# Altium schematic sheet PDB_Sheet1.SchDoc: PDB1.0_Core
size A2; SheetNumber: 1; SheetTotal: 1
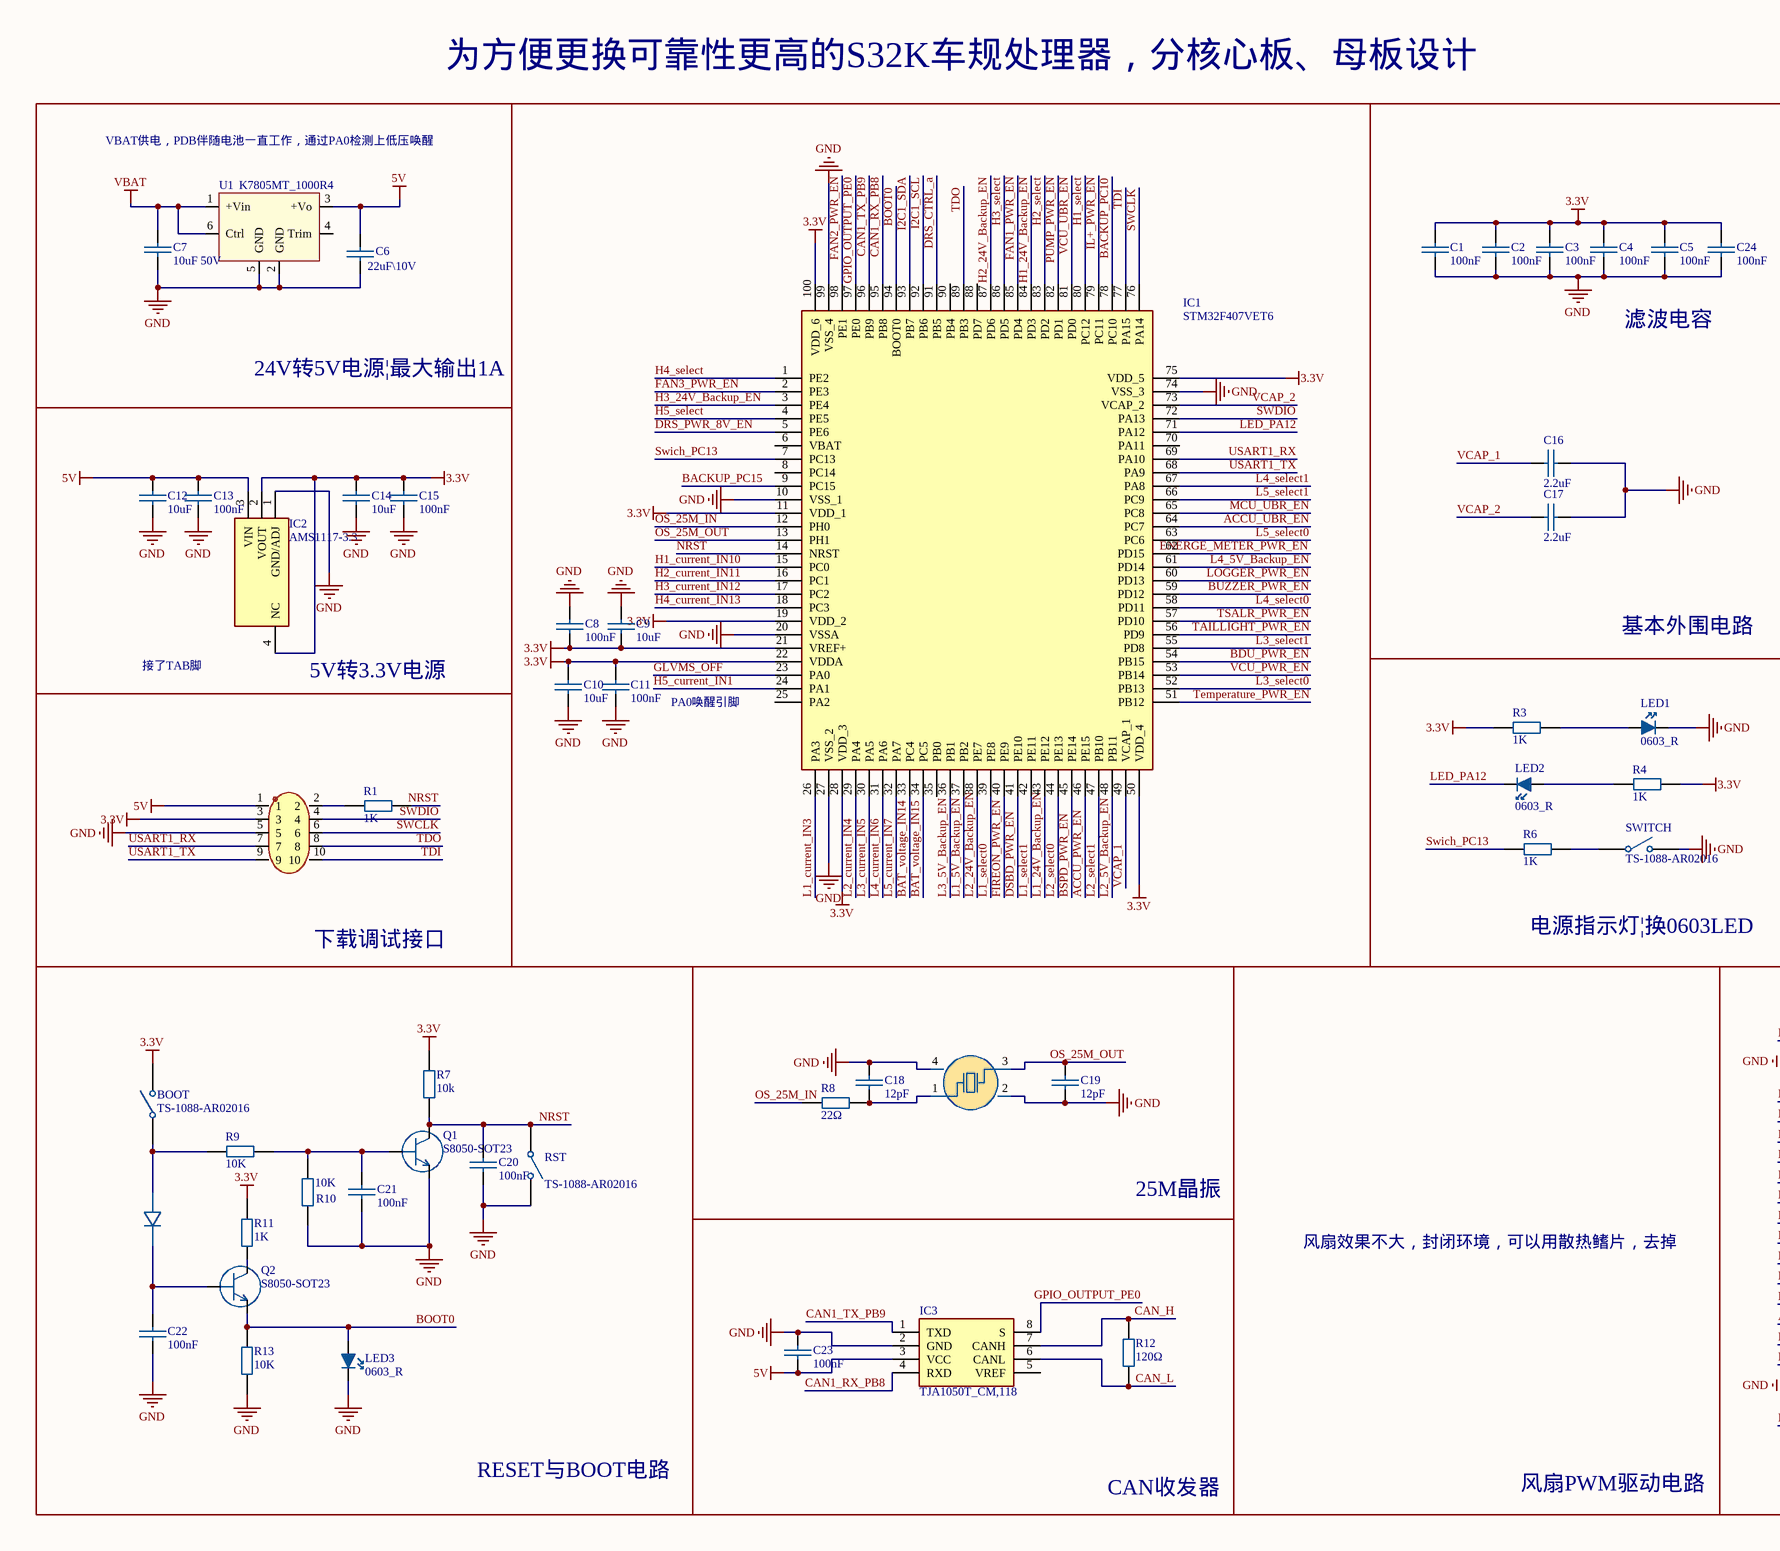
[diagram p0: PDB_Sheet1.SchDoc, left]
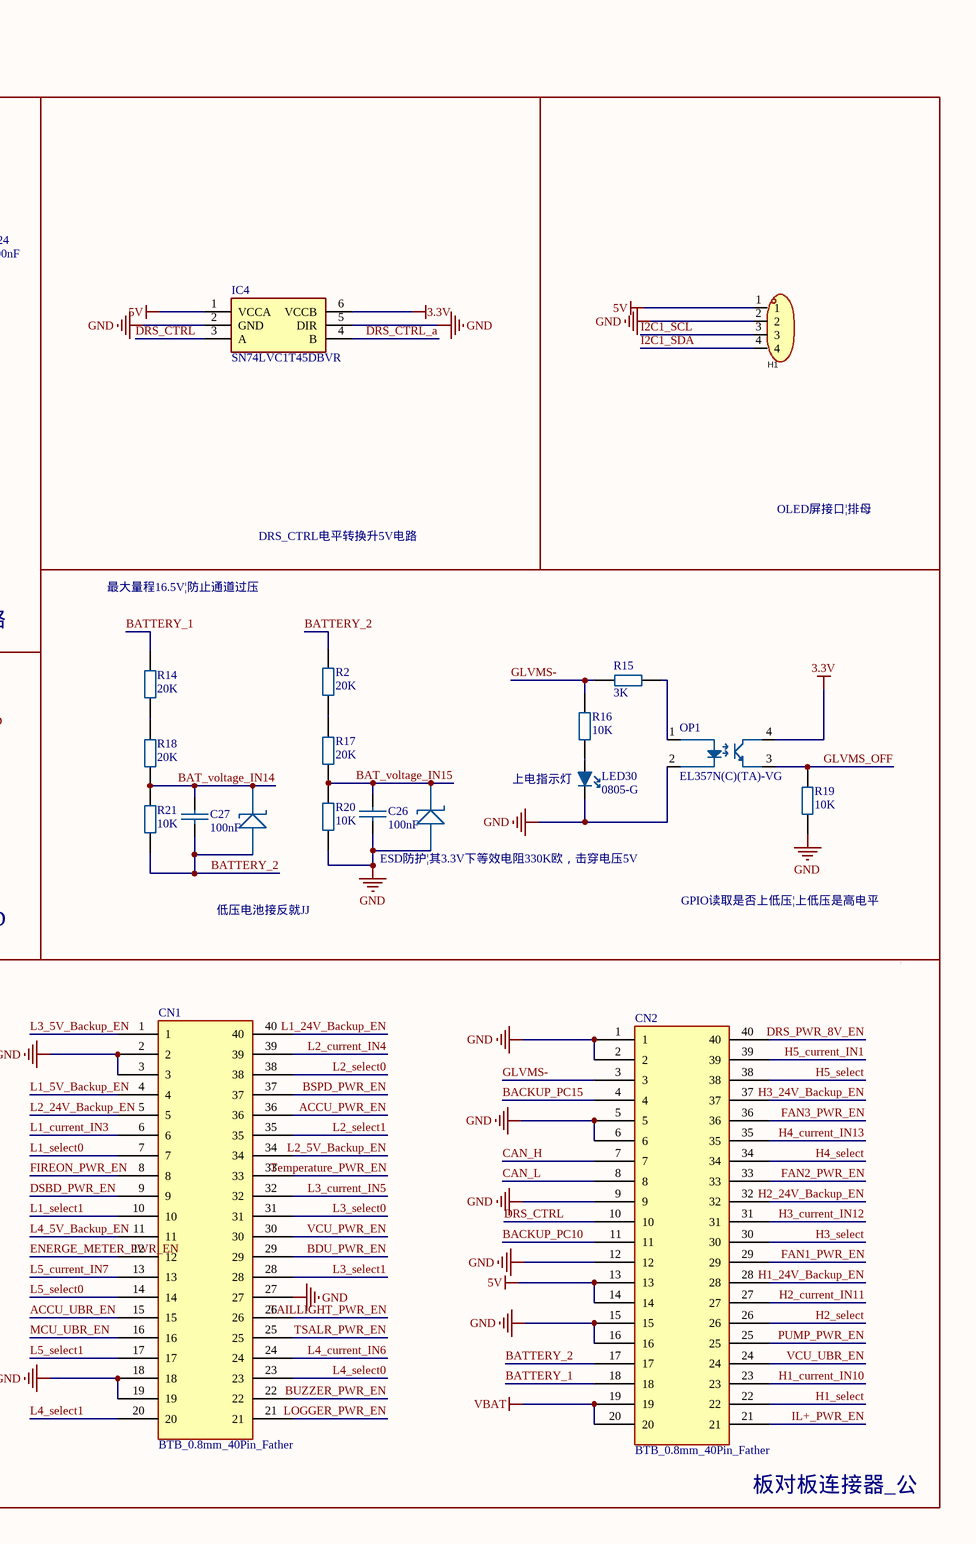
[diagram p1: PDB_Sheet1.SchDoc, right]

## Parts
BOOT  TS-1088-AR02016  [SW-SMD_L3.9-W3.0-P4.45]
C1  100nF  [CAPC1608X08N__0603CAPUNPOLE]
C2  100nF  [CAPC1608X08N__0603CAPUNPOLE]
C3  100nF  [CAPC1608X08N__0603CAPUNPOLE]
C4  100nF  [CAPC1608X08N__0603CAPUNPOLE]
C5  100nF  [CAPC1608X08N__0603CAPUNPOLE]
C6  22uF\10V  [CAPC1608X08N__0603CAPUNPOLE]
C7  10uF 50V  [CAPC3216X16N_1206CAPUNPOLE]
C8  100nF  [CAPC1608X08N__0603CAPUNPOLE]
C9  10uF  [CAPC1608X08N__0603CAPUNPOLE]
C10  10uF  [CAPC1608X08N__0603CAPUNPOLE]
C11  100nF  [CAPC1608X08N__0603CAPUNPOLE]
C12  10uF  [CAPC1608X08N__0603CAPUNPOLE]
C13  100nF  [CAPC1608X08N__0603CAPUNPOLE]
C14  10uF  [CAPC1608X08N__0603CAPUNPOLE]
C15  100nF  [CAPC1608X08N__0603CAPUNPOLE]
C16  2.2uF  [CAPC1608X08N__0603CAPUNPOLE]
C17  2.2uF  [CAPC1608X08N__0603CAPUNPOLE]
C18  12pF  [CAPC1608X08N__0603CAPUNPOLE]
C19  12pF  [CAPC1608X08N__0603CAPUNPOLE]
C20  100nF  [CAPC1608X08N__0603CAPUNPOLE]
C21  100nF  [CAPC1608X08N__0603CAPUNPOLE]
C22  100nF  [CAPC1608X08N__0603CAPUNPOLE]
C23  100nF  [CAPC1608X08N__0603CAPUNPOLE]
C24  100nF  [CAPC1608X08N__0603CAPUNPOLE]
C26  100nF  [CAPC1608X08N__0603CAPUNPOLE]
C27  100nF  [CAPC1608X08N__0603CAPUNPOLE]
CN1  BTB_0.8mm_40Pin_Father  [BTB_0.8mm_40PIN_F]
CN2  BTB_0.8mm_40Pin_Father  [BTB_0.8mm_40PIN_F]
D1  1N4148WS_C2128  [SOD-323_L1.8-W1.3-LS2.5-RD]  (value not drawn)
E1  CESD3V3D3 YU  [SOD-323_L1.8-W1.3-LS2.5-RD]  (value not drawn)
E2  CESD3V3D3 YU  [SOD-323_L1.8-W1.3-LS2.5-RD]  (value not drawn)
H1  2.54-1*4P母  [HDR-TH_4P-P2.54-V-F]  (value not drawn)
IC1  STM32F407VET6  [QFP50P1600X1600X160-100N]
IC2  AMS1117-3.3  [SOT229P700X180-4N]
IC3  TJA1050T_CM,118  [SOIC127P600X175-8N]
IC4  SN74LVC1T45DBVR  [SOT95P280X145-6N]
LED1  0603_R  [LED0603-RD_RED]
LED2  0603_R  [LED0603-RD_RED]
LED3  0603_R  [LED0603-RD_RED]
LED30  0805-G  [DIOC2012X11N__0805DIO]
OP1  EL357N(C)(TA)-VG  [SOP-4-2.54mm]
Q1  S8050-SOT23  [SOT95P245X110-3N]
Q2  S8050-SOT23  [SOT95P245X110-3N]
R1  1K  [RESC3116X06N__1206RES]
R2  20K  [RESC1608X04N_0603RES]
R3  1K  [RESC1608X04N_0603RES]
R4  1K  [RESC1608X04N_0603RES]
R6  1K  [RESC1608X04N_0603RES]
R7  10k  [RESC1608X04N_0603RES]
R8  22Ω  [RESC1608X04N_0603RES]
R9  10K  [RESC1608X04N_0603RES]
R10  10K  [RESC1608X04N_0603RES]
R11  1K  [RESC1608X04N_0603RES]
R12  120Ω  [RESC1608X04N_0603RES]
R13  10K  [RESC1608X04N_0603RES]
R14  20K  [RESC1608X04N_0603RES]
R15  3K  [RESC1608X04N_0603RES]
R16  10K  [RESC1608X04N_0603RES]
R17  20K  [RESC1608X04N_0603RES]
R18  20K  [RESC1608X04N_0603RES]
R19  10K  [RESC1608X04N_0603RES]
R20  10K  [RESC1608X04N_0603RES]
R21  10K  [RESC1608X04N_0603RES]
RST  TS-1088-AR02016  [SW-SMD_L3.9-W3.0-P4.45]
SWITCH  TS-1088-AR02016  [SW-SMD_L3.9-W3.0-P4.45]
U1  K7805MT_1000R4  [K7805MT_500R4]
U2  ZX-PZ2.54-2-5PZZ  [HDR-TH_10P-P2.54-V-M-R2-C5-S2.54]  (value not drawn)
X1  X322525MOB4SI  [OSC-SMD_4P-L3.2-W2.5-BL]  (value not drawn)

## Blocks framed on the sheet
24V转5V电源¦最大输出1A: C6 C7 U1
PA0唤醒引脚: C8-C11 IC1
DRS_CTRL电平转换升5V电路: IC4
OLED屏接口¦排母: H1
5V转3.3V电源: C12-C15 IC2
25M晶振: C18 C19 R8 X1
板对板连接器_公: CN1 CN2
CAN收发器: C23 IC3 R12

## Nets
3.3V: BOOT.2(NO) C1.2 C2.2 C3.2 C4.2 C5.2 C8.2 C9.2 C10.2 C11.2 C14.2 C15.2 C24.2 IC1.11(VDD_1) IC1.19(VDD_2) IC1.21(VREF+) IC1.22(VDDA) IC1.28(VDD_3) IC1.50(VDD_4) IC1.75(VDD_5) IC1.100(VDD_6) IC2.2(VOUT) IC2.4(NC) IC4.6(VCCB) OP1.4 R3.1 R4.2 R7.2 R11.2 U2.3
5V: C6.2 C12.2 C13.2 C23.2 CN2.13 CN2.14 H1.1 IC2.3(VIN) IC3.3(VCC) IC4.1(VCCA) U1.3(+Vo) U2.1
GND: C1.1 C2.1 C3.1 C4.1 C5.1 C6.1 C7.1 C8.1 C9.1 C10.1 C11.1 C12.1 C13.1 C14.1 C15.1 C16.2 C17.2 C18.2 C19.1 C20.1 C21.1 C22.1 C23.1 C24.1 C26.1 CN1.2 CN1.3 CN1.18 CN1.19 CN1.27 CN2.1 CN2.2 CN2.5 CN2.6 CN2.9 CN2.12 CN2.15 CN2.16 E1.2 H1.2 IC1.10(VSS_1) IC1.20(VSSA) IC1.27(VSS_2) IC1.74(VSS_3) IC1.99(VSS_4) IC2.1(GND/ADJ) IC3.2(GND) IC4.2(GND) IC4.5(DIR) LED1.1 LED3.1 LED30.1 OP1.2 Q1.2(Emitter) R10.1 R13.1 R19.1 R20.2 RST.2(NO) SWITCH.2(NO) U1.2(GND) U1.5(GND) U2.5 X1.2(GND) X1.4(GND)
VBAT: C7.2 CN2.19 CN2.20 U1.1(+Vin) U1.6(Ctrl)
ACCU_PWR_EN: CN1.36 IC1.46(PE15)
ACCU_UBR_EN: CN1.15 IC1.64(PC7)
BACKUP_PC10: CN2.11 IC1.78(PC10)
BACKUP_PC15: CN2.4 IC1.9(PC15)
BAT_voltage_IN14: C27.2 E2.1 IC1.33(PC4) R18.2 R21.1
BAT_voltage_IN15: C26.2 E1.1 IC1.34(PC5) R17.2 R20.1
BATTERY_1: CN2.18 R14.2
BATTERY_2: C27.1 CN2.17 E2.2 R2.2 R21.2
BDU_PWR_EN: CN1.29 IC1.54(PB15)
BOOT0: IC1.94(BOOT0) LED3.2 Q2.2(Emitter) R13.2
BSPD_PWR_EN: CN1.37 IC1.45(PE14)
BUZZER_PWR_EN: CN1.22 IC1.59(PD12)
CAN1_RX_PB8: IC1.95(PB8) IC3.4(RXD)
CAN1_TX_PB9: IC1.96(PB9) IC3.1(TXD)
CAN_H: CN2.7 IC3.7(CANH) R12.2
CAN_L: CN2.8 IC3.6(CANL) R12.1
DRS_CTRL: CN2.10 IC4.3(A)
DRS_CTRL_a: IC1.91(PB5) IC4.4(B)
DRS_PWR_8V_EN: CN2.40 IC1.5(PE6)
DSBD_PWR_EN: CN1.9 IC1.41(PE10)
ENERGE_METER_PWR_EN: CN1.12 IC1.62(PD15)
FAN1_PWR_EN: CN2.29 IC1.85(PD4)
FAN2_PWR_EN: CN2.33 IC1.98(PE1)
FAN3_PWR_EN: CN2.36 IC1.2(PE3)
FIREON_PWR_EN: CN1.8 IC1.40(PE9)
GLVMS-: CN2.3 R15.2 R16.2
GLVMS_OFF: IC1.23(PA0) OP1.3 R19.2
GPIO_OUTPUT_PE0: IC1.97(PE0) IC3.8(S)
H1_24V_Backup_EN: CN2.28 IC1.84(PD3)
H1_current_IN10: CN2.23 IC1.15(PC0)
H1_select: CN2.22 IC1.80(PC12)
H2_24V_Backup_EN: CN2.32 IC1.87(PD6)
H2_current_IN11: CN2.27 IC1.16(PC1)
H2_select: CN2.26 IC1.83(PD2)
H3_24V_Backup_EN: CN2.37 IC1.3(PE4)
H3_current_IN12: CN2.31 IC1.17(PC2)
H3_select: CN2.30 IC1.86(PD5)
H4_current_IN13: CN2.35 IC1.18(PC3)
H4_select: CN2.34 IC1.1(PE2)
H5_current_IN1: CN2.39 IC1.24(PA1)
H5_select: CN2.38 IC1.4(PE5)
I2C1_SCL: H1.3 IC1.92(PB6)
I2C1_SDA: H1.4 IC1.93(PB7)
IL+_PWR_EN: CN2.21 IC1.79(PC11)
L1_5V_Backup_EN: CN1.4 IC1.37(PB2)
L1_24V_Backup_EN: CN1.40 IC1.43(PE12)
L1_current_IN3: CN1.6 IC1.26(PA3)
L1_select0: CN1.7 IC1.39(PE8)
L1_select1: CN1.10 IC1.42(PE11)
L2_5V_Backup_EN: CN1.34 IC1.48(PB11)
L2_24V_Backup_EN: CN1.5 IC1.38(PE7)
L2_current_IN4: CN1.39 IC1.29(PA4)
L2_select0: CN1.38 IC1.44(PE13)
L2_select1: CN1.35 IC1.47(PB10)
L3_5V_Backup_EN: CN1.1 IC1.36(PB1)
L3_current_IN5: CN1.32 IC1.30(PA5)
L3_select0: CN1.31 IC1.52(PB13)
L3_select1: CN1.28 IC1.55(PD8)
L4_5V_Backup_EN: CN1.11 IC1.61(PD14)
L4_current_IN6: CN1.24 IC1.31(PA6)
L4_select0: CN1.23 IC1.58(PD11)
L4_select1: CN1.20 IC1.67(PA8)
L5_current_IN7: CN1.13 IC1.32(PA7)
L5_select0: CN1.14 IC1.63(PC6)
L5_select1: CN1.17 IC1.66(PC9)
LED_PA12: IC1.71(PA12) LED2.1
LOGGER_PWR_EN: CN1.21 IC1.60(PD13)
MCU_UBR_EN: CN1.16 IC1.65(PC8)
NRST: C20.2 IC1.14(NRST) Q1.3(Collector) R1.2 R7.1 RST.1(COMMON)
OS_25M_IN: IC1.12(PH0) R8.1
OS_25M_OUT: C19.2 IC1.13(PH1) X1.3(OSC2)
PUMP_PWR_EN: CN2.25 IC1.82(PD1)
SWCLK: IC1.76(PA14) U2.6
SWDIO: IC1.72(PA13) U2.4
Swich_PC13: IC1.7(PC13) R6.1
TAILLIGHT_PWR_EN: CN1.26 IC1.56(PD9)
TDI: IC1.77(PA15) U2.10
TDO: IC1.89(PB3) U2.8
Temperature_PWR_EN: CN1.33 IC1.51(PB12)
TSALR_PWR_EN: CN1.25 IC1.57(PD10)
USART1_RX: IC1.69(PA10) U2.7
USART1_TX: IC1.68(PA9) U2.9
VCAP_1: C16.1 IC1.49(VCAP_1)
VCAP_2: C17.1 IC1.73(VCAP_2)
VCU_PWR_EN: CN1.30 IC1.53(PB14)
VCU_UBR_EN: CN2.24 IC1.81(PD0)
NetBOOT_1: BOOT.1(COMMON) D1.2(A) R9.1
NetC18_1: C18.1 R8.2 X1.1(OSC1)
NetC21_2: C21.2 Q1.1(Base) R9.2 R10.2
NetC22_2: C22.2 D1.1(K) Q2.1(Base)
NetLED1_2: LED1.2 R3.2
NetLED2_2: LED2.2 R4.1
NetLED30_2: LED30.2 R16.1
NetOP1_1: OP1.1 R15.1
NetQ2_3: Q2.3(Collector) R11.1
NetR1_1: R1.1 U2.2
NetR2_1: R2.1 R17.1
NetR6_2: R6.2 SWITCH.1(COMMON)
NetR14_1: R14.1 R18.1

Not connected (* = marked no-connect by the designer): IC1 6(VBAT) 8(PC14) 25(PA2) 35(PB0) 70(PA11) 88(PD7) 90(PB4); IC3 5(VREF); U1 4(Trim)

## Notes on the sheet
- 为方便更换可靠性更高的S32K车规处理器，分核心板、母板设计
- VBAT供电，PDB伴随电池一直工作，通过PA0检测上低压唤醒
- 滤波电容
- 最大量程16.5V¦防止通道过压
- 基本外围电路
- 接了TAB脚
- 上电指示灯
- ESD防护¦其3.3V下等效电阻330K欧，击穿电压5V
- 电源指示灯¦换0603LED
- 低压电池接反就JJ
- GPIO读取是否上低压¦上低压是高电平
- 下载调试接口
- 风扇效果不大，封闭环境，可以用散热鳍片，去掉
- RESET与BOOT电路
- 风扇PWM驱动电路
- ENG:
- DSN:
- APPROVALS
- DATE
- PROJECT REVISION:
- Vehicle Number:
- E33
- DOCUMENT REVISION:
- Wuhan University of Techonology
- Formula Student Electric Racing Team
- No. 122, Luoshi Road, Wuhan
- Hubei Provence, China
- Design Item:
- CHK:
- BOM:
- REFERENCE DOCUMENTS
- TITLE
- FAB DWG:
- PCB DWG:
- ASSY DWG:
- SCALE:
- A1
- SIZE
- FILE NAME
- WUTE racing team
- SHEET
- OF
- REV

## Library data of the parts
BOOT RST SWITCH = TS-1088-AR02016: Switch; Manufacturer_Name: XUNPU; Datasheet Link: https://www.xunpudianzi.com/uploads/pdf/TS-1088-ARXXX.pdf; Height: 2mm; Manufacturer_Part_Number: TS-1088-AR02016
C1-C5 C8-C24 C26 C27 = SMD_MLCC: Std MLCC Cap; voltage rating: ?V
  C1-C5 C8 C11 C13 C15 C20-C24 C26 C27: Type: 100nF
  C9 C10 C12 C14: Type: 10uF
  C16 C17: Type: 2.2uF
  C18 C19: Type: 12pF
C6 C7 = SMD_MLCC: Std MLCC Cap
  C6: Type: 22uF\10V
  C7: Type: 10uF 50V
CN1 CN2 = BTB_0.8mm_40Pin_Father: System: Connector
D1 = 1N4148WS_C2128: 二极管配置:独立式;功率:200mW;直流反向耐压(Vr):100V;平均整流电流(Io):150mA;正向压降(Vf):1.25V@150mA;反向电流(Ir):1uA@75V;反向恢复时间(trr):4ns;工作温度:+150℃@(Tj);; Manufacturer: CJ(江苏长电/长晶); Symbol: 1N4148WS T4; Add into BOM: yes; Diode Configuration: 独立式; Power Dissipation: 200mW; Reverse Voltage (Vr): 100V; Average Rectified Current (Io): 150mA; Reverse Recovery Time (trr): 4ns; Name: 1N4148WS; Device: 1N4148WS_C2128; LCSC Part Name: 100V 150mA 4ns T4; Supplier Part: C2128; Manufacturer Part: 1N4148WS; Supplier Footprint: SOD-323; Supplier: LCSC; Convert to PCB: yes; Forward Voltage (Vf@If): 1.25V@150mA; Reverse Leakage Current: 1uA@75V; Operating Temperature: +150℃@(Tj)
E1 E2 = CESD3V3D3 YU: 极性:单向;反向截止电压(Vrwm):3.3V;击穿电压(VBR):5V;钳位电压(Vc)@Ipp:13V;; Manufacturer: CJ(江苏长电/长晶); Add into BOM: yes; Polarity: 单向; Reverse Stand-Off Voltage (Vrwm): 3.3V; Breakdown Voltage (VBR): 5V; Peak Pulse Current(Ipp)@8/20us: 16A; Clamping Voltage@Ipp: 13V; Name: CESD3V3D3 YU; Symbol: CESD3V3D3; Device: CESD3V3D3 YU; LCSC Part Name: 单向ESD; Supplier Part: C38388; Manufacturer Part: CESD3V3D3 YU; Supplier Footprint: SOD-323; Datasheet: https://atta.szlcsc.com/upload/public/pdf/source/20150915/1457707371129.pdf; Supplier: LCSC; Convert to PCB: yes
H1 = 2.54-1*4P母: 立创编号：C2718488; Manufacturer: BOOMELE(博穆精密); Add into BOM: yes; Holes Structure: 1x4P; Pitch: 2.54mm; Circular Hole / Square Hole: 方孔; Number of Holes: 4P; Current Rating (Max): 3A; Holes Direction: 顶部; Symbol: 2.54-1*4P母; Device: 2.54-1*4P母; Supplier: LCSC; Supplier Part: C2718488; Manufacturer Part: 2.54-1*4P母; JLCPCB Part Class: Extended Part; LCSC Part Name: 间距:2.54mm 1x4P 直插; Supplier Footprint: 插件,P=2.54mm; Datasheet: https://atta.szlcsc.com/upload/public/pdf/source/20210301/C2718488_F4427B881E42CAA8DDB0B1C12B3A522C.pdf; Convert to PCB: yes; Row Spacing: -; Mounting Type: 直插; Number of Rows: 单排; Voltage Rating (Max): -; Insulation Height: -; Contact Material: 青铜; Contact Plating: -; Operating Temperature Range: -40℃~+105℃; Soldering Temperature(Max): -
IC1 = STM32F407VET6: Integrated Circuit; Manufacturer_Name: STMicroelectronics; Datasheet Link: http://www.st.com/web/en/resource/technical/document/datasheet/DM00037051.pdf; Height: 1.6mm; Manufacturer_Part_Number: STM32F407VET6; Mouser Part Number: 511-STM32F407VET6; Mouser Price/Stock: https://www.mouser.co.uk/ProductDetail/STMicroelectronics/STM32F407VET6?qs=Z8%252BeY1k3TIJFAMMqSR%252BGtw%3D%3D; Arrow Part Number: STM32F407VET6; Arrow Price/Stock: https://www.arrow.com/en/products/stm32f407vet6/stmicroelectronics?region=nac
IC2 = AMS1117-3.3: Integrated Circuit; Manufacturer_Name: Advanced; Datasheet Link: https://datasheet.datasheetarchive.com/originals/distributors/Datasheets-28/DSA-550594.pdf; Height: 1.8mm; Manufacturer_Part_Number: AMS1117-3.3
IC3 = TJA1050T_CM,118: Integrated Circuit; Manufacturer_Name: NXP; Manufacturer_Part_Number: TJA1050T/CM,118; Datasheet Link: http://www.nxp.com/docs/en/data-sheet/TJA1050.pdf; Height: 1.75mm; Mouser Part Number: 771-TJA1050T/CM118; Mouser Price/Stock: https://www.mouser.co.uk/ProductDetail/NXP-Semiconductors/TJA1050T-CM118?qs=5XOdhvmYM0NFFspw0VP5sA%3D%3D; Arrow Part Number: TJA1050T/CM,118; Arrow Price/Stock: https://www.arrow.com/en/products/tja1050tcm118/nxp-semiconductors?region=europe
IC4 = SN74LVC1T45DBVR: Integrated Circuit / 电平转换模块 立创编号：C7843; Manufacturer_Name: Texas Instruments; Datasheet Link: https://componentsearchengine.com/Datasheets/2/SN74LVC1T45DBVR.pdf; Height: 1.45mm; Manufacturer_Part_Number: SN74LVC1T45DBVR; Mouser Part Number: 595-SN74LVC1T45DBVR; Mouser Price/Stock: https://www.mouser.co.uk/ProductDetail/Texas-Instruments/SN74LVC1T45DBVR?qs=pajgIaoyDUhg6sKXdsM%2Fvg%3D%3D; Arrow Part Number: SN74LVC1T45DBVR; Arrow Price/Stock: https://www.arrow.com/en/products/sn74lvc1t45dbvr/texas-instruments?region=nac
LED1-LED3 = LED: Light Emitting Diode; Type: 0805-R; Type2: DIP-HDR1*2-R
LED30 = LED: Light Emitting Diode; Type2: DIP-HDR1*2-R; Type: 0805-G
OP1 = EL357N(C)(TA)-VG: No Description Available / 立创编号：C108648; Mfr_Name: Everlight; RefDes: RefDes; Type: Type
Q1 Q2 = S8050: Jellybeam NPN; Type: S8050-SOT23
R1-R4 R6-R14 R20 R21 = SMD_Resistor: Std Resistor; power rating: 100mW; voltage rating: 75V
  R1 R3 R4 R6 R11: Type: 1K
  R2 R14: Type: 20K
  R7: Type: 10k
  R8: Type: 22Ω
  R9 R10 R13 R20 R21: Type: 10K
  R12: Type: 120Ω
R15-R19 = SMD_Resistor: Std Resistor
  R15: Type: 3K
  R16 R19: Type: 10K
  R17 R18: Type: 20K
U1 = K78052MT_1000R4
U2 = ZX-PZ2.54-2-5PZZ: Manufacturer: Megastar(兆星); Add into BOM: yes; Pin Structure: 2x5P; Pitch: 2.54mm; Circluar Pins/Square Pins: 方针; Current Rating (Max): 3A; Voltage Rating (Max): 1kV; Soldering Temperature(Max): 260℃@5s; Symbol: ZX-PZ2.54-2-5PZZ; Device: ZX-PZ2.54-2-5PZZ; Supplier: LCSC; Supplier Part: C7501276; Manufacturer Part: ZX-PZ2.54-2-5PZZ; JLCPCB Part Class: Extended Part; LCSC Part Name: 间距:2.54mm 2x5P 直插 方针; Supplier Footprint: 插件,P=2.54mm; Datasheet: https://atta.szlcsc.com/upload/public/pdf/source/20231122/7DD2FA5A7FDBC10CDDB6051CB6BC6AD1.pdf; Convert to PCB: yes; Row Spacing: 2.54mm; Mounting Type: 直插; Number of Rows: 双排; Number of Pins: 5P; Length of Mating Pin: 6mm; Insulation Height: 2.5mm; Length of End Connection Pin: 3mm; Contact Material: 黄铜; Contact Plating: 金; Operating Temperature Range: -40℃~+105℃; Color: 黑色
X1 = X322525MOB4SI: 频率:25MHz;频率公差:±10ppm;负载电容:12pF;; Manufacturer: YXC(扬兴晶振); Name: 25MHz; Add into BOM: yes; Crystal Type: 贴片无源晶振; Value: 25MHz; Frequency Tolerance: ±10ppm; Frequency Stability: ±30ppm; Load Capacitance: 12pF; Symbol: X322525MOB4SI; Device: X322525MOB4SI; LCSC Part Name: 25MHz ±10ppm 12pF YSX321SL; Supplier Part: C9006; Manufacturer Part: X322525MOB4SI; Supplier Footprint: SMD3225-4P; Datasheet: https://atta.szlcsc.com/upload/public/pdf/source/20210329/C112971_1F611BDC486E193C1706F6D8EB5AA189.pdf; Supplier: LCSC; Convert to PCB: yes; Operating Temperature: -40℃~+85℃